# Altium project RBCM_Mother.PrjPcb (part 2 of 2)

## Sheet Sheet2.SchDoc: RBCM_Mother
size 419 x 297 mm; SheetNumber: 2; SheetTotal: 3; SCH_SCALE: Not to Scale; PrjRev: A; DocRev: A; Team: WUTE Racing Team
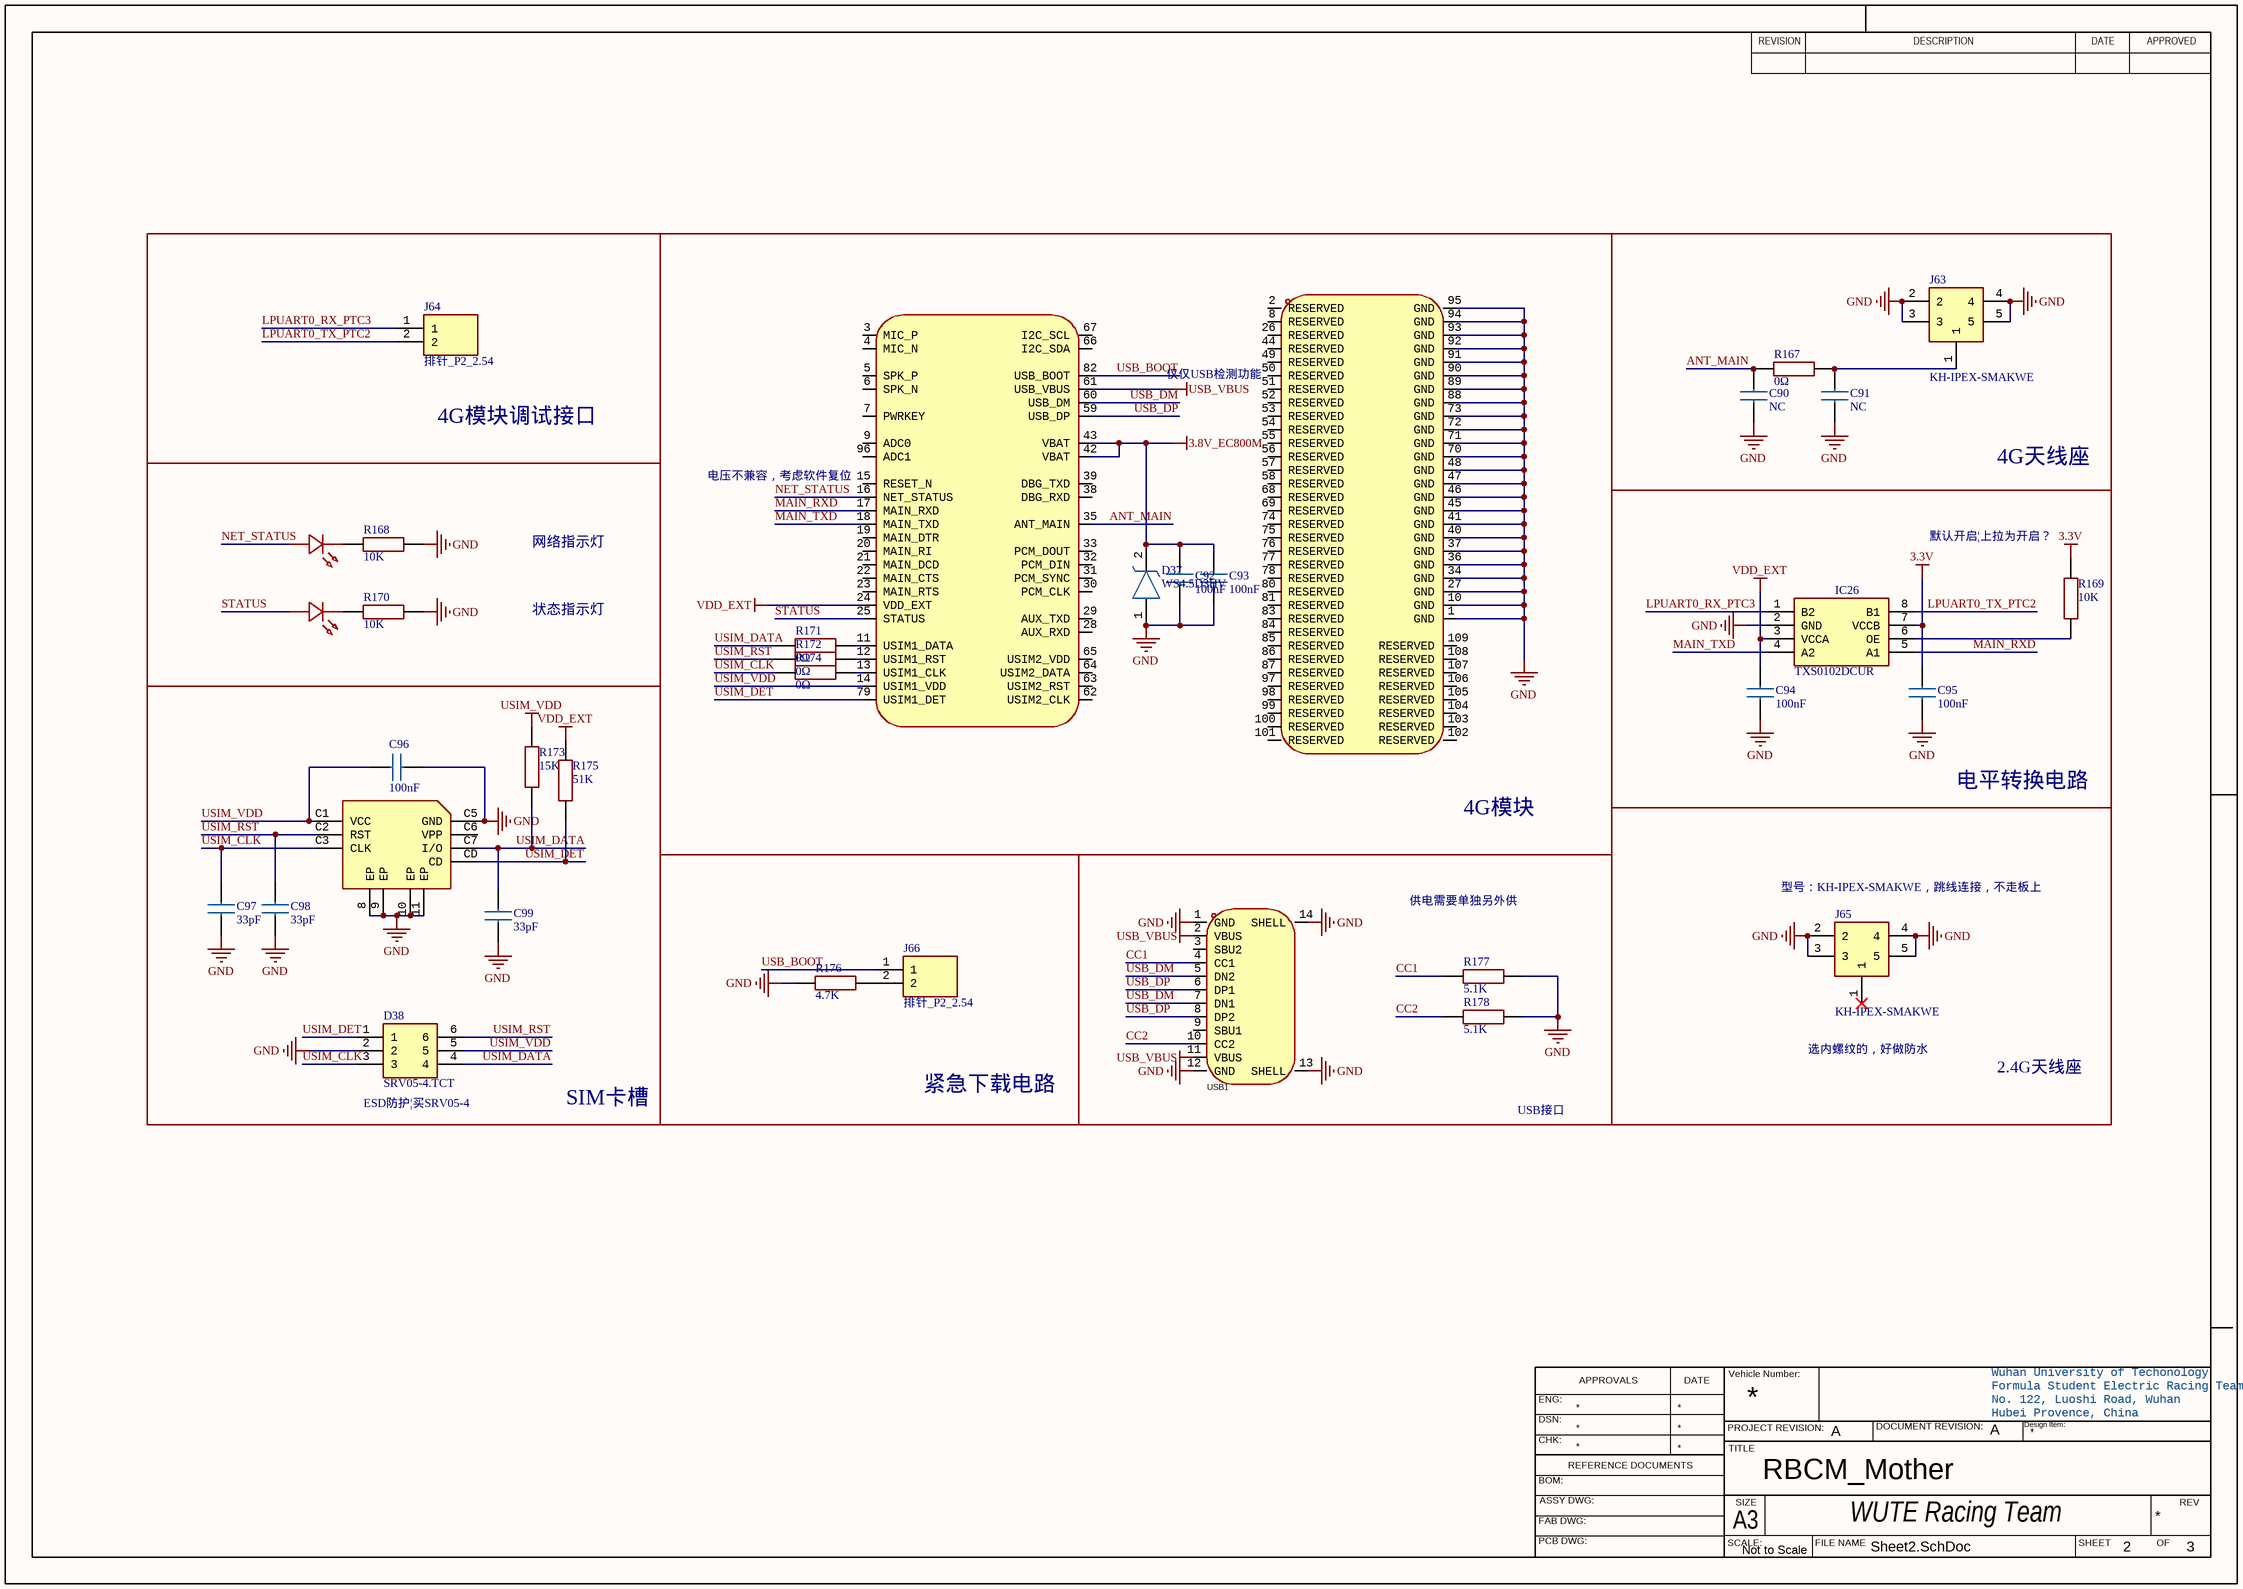
[diagram p6: Sheet2.SchDoc]

### Parts
C90  NC  [CAPC1608X90N]
C91  NC  [CAPC1608X90N]
C92  100nF  [CAPC1608X90N]
C93  100nF  [CAPC1608X90N]
C94  100nF  [CAPC1608X90N]
C95  100nF  [CAPC1608X90N]
C96  100nF  [CAPC1608X90N]
C97  33pF  [CAPC1608X90N]
C98  33pF  [CAPC1608X90N]
C99  33pF  [CAPC1608X90N]
CARD1  SMN-303  [SIM-SMD_SMN-303]  (value not drawn)
D37  WS4.5D3HV  [WS45D3HV]
D38  SRV05-4.TCT  [SOT95P280X145-6N]
IC26  TXS0102DCUR  [SOP50P310X90-8N]
J63  KH-IPEX-SMAKWE  [KHIPEXSMAKWE]
J64  排针_P2_2.54  [HDRV2W66P0X254_1X2_508X250X880P]
J65  KH-IPEX-SMAKWE  [KHIPEXSMAKWE]
J66  排针_P2_2.54  [HDRV2W66P0X254_1X2_508X250X880P]
LED3  XL-1606UGC  [LED-SMD_L1.7-W1.1-R-RD_GREEN]  (value not drawn)
LED4  XL-1606UGC  [LED-SMD_L1.7-W1.1-R-RD_GREEN]  (value not drawn)
R167  0Ω  [RESC1608X55N]
R168  10K  [RESC1608X55N]
R169  10K  [RESC1608X55N]
R170  10K  [RESC1608X55N]
R171  0Ω  [RESC1608X55N]
R172  0Ω  [RESC1608X55N]
R173  15K  [RESC1608X55N]
R174  0Ω  [RESC1608X55N]
R175  51K  [RESC1608X55N]
R176  4.7K  [RESC1608X55N]
R177  5.1K  [RESC1608X55N]
R178  5.1K  [RESC1608X55N]
U2  EC800MCNGA-I05-SGNSA  [LCC-109_L17.7-W15.8-P1.10_EC800M-CN]  (value not drawn)  (parts A,B of 2)
USB1  TYPE-C 16PIN 2MD(073)  [USB-C-SMD_TYPE-C-6PIN-2MD-073]  (value not drawn)

### Blocks framed on the sheet
4G模块调试接口: J64
4G模块: C92 C93 D37 R171 R172 R174 U2
4G天线座: C90 C91 J63 R167
默认开启¦上拉为开启？: C94 C95 IC26 R169
SIM卡槽: C96-C99 CARD1 D38 R173 R175
紧急下载电路: J66 R176
电平转换电路: J65

### Nets
3.3V: C95.1 IC26.7(VCCB) R169.1
3.8V_EC800M: C92.2 C93.2 D37.2(K) U2.42(VBAT) U2.43(VBAT)
GND: C90.1 C91.1 C92.1 C93.1 C94.2 C95.2 C96.1 C97.2 C98.2 C99.2 CARD1.8(EP) CARD1.9(EP) CARD1.10(EP) CARD1.11(EP) CARD1.C5(GND) D37.1(A) D38.2 IC26.2(GND) J63.2 J63.3 J63.4 J63.5 J65.2 J65.3 J65.4 J65.5 R168.1 R170.1 R176.1 R177.2 R178.2 U2.1(GND) U2.10(GND) U2.27(GND) U2.34(GND) U2.36(GND) U2.37(GND) U2.40(GND) U2.41(GND) U2.45(GND) U2.46(GND) U2.47(GND) U2.48(GND) U2.70(GND) U2.71(GND) U2.72(GND) U2.73(GND) U2.88(GND) U2.89(GND) U2.90(GND) U2.91(GND) U2.92(GND) U2.93(GND) U2.94(GND) U2.95(GND) USB1.1(GND) USB1.12(GND) USB1.13(SHELL) USB1.14(SHELL)
USB_VBUS: U2.61(USB_VBUS) USB1.2(VBUS) USB1.11(VBUS)
USIM_VDD: C96.2 CARD1.C1(VCC) D38.5 R173.2 U2.14(USIM1_VDD)
VDD_EXT: C94.1 IC26.3(VCCA) R175.2 U2.24(VDD_EXT)
ANT_MAIN: C90.2 R167.1 U2.35(ANT_MAIN)
CC1: R177.1 USB1.4(CC1)
CC2: R178.1 USB1.10(CC2)
LPUART0_RX_PTC3: IC26.1(B2) J64.1
LPUART0_TX_PTC2: IC26.8(B1) J64.2
MAIN_RXD: IC26.5(A1) U2.17(MAIN_RXD)
MAIN_TXD: IC26.4(A2) U2.18(MAIN_TXD)
NET_STATUS: LED3.1(A) U2.16(NET_STATUS)
STATUS: LED4.1(A) U2.25(STATUS)
USB_BOOT: J66.1 U2.82(USB_BOOT)
USB_DM: U2.60(USB_DM) USB1.5(DN2) USB1.7(DN1)
USB_DP: U2.59(USB_DP) USB1.6(DP1) USB1.8(DP2)
USIM_CLK: C97.1 CARD1.C3(CLK) D38.3 R174.1
USIM_DATA: C99.1 CARD1.C7(I/O) D38.4 R171.1 R173.1
USIM_DET: CARD1.CD D38.1 R175.1 U2.79(USIM1_DET)
USIM_RST: C98.1 CARD1.C2(RST) D38.6 R172.1
NetC91_2: C91.2 J63.1 R167.2
NetIC26_6: IC26.6(OE) R169.2
NetJ66_2: J66.2 R176.2
NetLED3_2: LED3.2(K) R168.2
NetLED4_2: LED4.2(K) R170.2
NetR171_2: R171.2 U2.11(USIM1_DATA)
NetR172_2: R172.2 U2.12(USIM1_RST)
NetR174_2: R174.2 U2.13(USIM1_CLK)

Not connected (* = marked no-connect by the designer): CARD1 C6(VPP); J65 1*; U2 2(RESERVED) 3(MIC_P) 4(MIC_N) 5(SPK_P) 6(SPK_N) 7(PWRKEY) 8(RESERVED) 9(ADC0) 15(RESET_N) 19(MAIN_DTR) 20(MAIN_RI) 21(MAIN_DCD) 22(MAIN_CTS) 23(MAIN_RTS) 26(RESERVED) 28(AUX_RXD) 29(AUX_TXD) 30(PCM_CLK) 31(PCM_SYNC) 32(PCM_DIN) 33(PCM_DOUT) 38(DBG_RXD) 39(DBG_TXD) 44(RESERVED) 49(RESERVED) 50(RESERVED) 51(RESERVED) 52(RESERVED) 53(RESERVED) 54(RESERVED) 55(RESERVED) 56(RESERVED) 57(RESERVED) 58(RESERVED) 62(USIM2_CLK) 63(USIM2_RST) 64(USIM2_DATA) 65(USIM2_VDD) 66(I2C_SDA) 67(I2C_SCL) 68(RESERVED) 69(RESERVED) 74(RESERVED) 75(RESERVED) 76(RESERVED) 77(RESERVED) 78(RESERVED) 80(RESERVED) 81(RESERVED) 83(RESERVED) 84(RESERVED) 85(RESERVED) 86(RESERVED) 87(RESERVED) 96(ADC1) 97(RESERVED) 98(RESERVED) 99(RESERVED) 100(RESERVED) 101(RESERVED) 102(RESERVED) 103(RESERVED) 104(RESERVED) 105(RESERVED) 106(RESERVED) 107(RESERVED) 108(RESERVED) 109(RESERVED); USB1 3(SBU2) 9(SBU1)

### Notes on the sheet
- 仅仅USB检测功能
- 电压不兼容，考虑软件复位
- 网络指示灯
- 状态指示灯
- 供电需要单独另外供
- (near J65) 型号：KH-IPEX-SMAKWE，跳线连接，不走板上
- 选内螺纹的，好做防水
- 2.4G天线座
- (near D38) ESD防护¦买SRV05-4
- USB接口
- REVISION
- DESCRIPTION
- DATE
- APPROVED
- ENG:
- APPROVALS
- Vehicle Number:
- Wuhan University of Techonology
- Formula Student Electric Racing Team
- No. 122, Luoshi Road, Wuhan
- DSN:
- CHK:
- REFERENCE DOCUMENTS
- PROJECT REVISION:
- TITLE
- DOCUMENT REVISION:
- Hubei Provence, China
- Design Item:
- BOM:
- FAB DWG:
- PCB DWG:
- ASSY DWG:
- SCALE:
- A3
- SIZE
- FILE NAME
- SHEET
- OF
- REV

### Library data of the parts
C90-C93 C96-C99 = C0603: Capacitor; Manufacturer_Name: YAGEO; Manufacturer_Part_Number: CC0603KRX7R9BB104; Datasheet Link: https://componentsearchengine.com/Datasheets/2/CC0603KRX7R9BB104.pdf; Height: 0.9mm; Mouser Part Number: 603-CC603KRX7R9BB104; Mouser Price/Stock: https://www.mouser.co.uk/ProductDetail/YAGEO/CC0603KRX7R9BB104?qs=vTakOoo5QyLvVCYM2ge8LQ%3D%3D; Arrow Part Number: CC0603KRX7R9BB104; Arrow Price/Stock: https://www.arrow.com/en/products/cc0603krx7r9bb104/yageo?region=europe
C94 C95 = C0603: Capacitor CC0603KRX7R9BB104; Manufacturer_Name: YAGEO; Datasheet Link: https://componentsearchengine.com/Datasheets/2/CC0603KRX7R9BB104.pdf; Height: 0.9mm; Manufacturer_Part_Number: CC0603KRX7R9BB104; Mouser Part Number: 603-CC603KRX7R9BB104; Mouser Price/Stock: https://www.mouser.co.uk/ProductDetail/YAGEO/CC0603KRX7R9BB104?qs=vTakOoo5QyLvVCYM2ge8LQ%3D%3D; Arrow Part Number: CC0603KRX7R9BB104; Arrow Price/Stock: https://www.arrow.com/en/products/cc0603krx7r9bb104/yageo?region=europe
CARD1 = SMN-303: Manufacturer: XUNPU(讯普); Add into BOM: yes; Card Connection Mode: 自弹式; Card Type: NanoSIM卡; Connector Type: 卡座; Card Detection: 有插卡检测; Body Height (Max): 1.37mm; Symbol: SMN-303; Device: SMN-303; LCSC Part Name: 自弹式 NanoSIM卡 卡座; Supplier Part: C266888; Manufacturer Part: SMN-303; Supplier Footprint: SMD; JLCPCB Part Class: Extended Part; Datasheet: https://atta.szlcsc.com/upload/public/pdf/source/20230608/69FA23A73293DEADC31E393DD83871F4.pdf; Supplier: LCSC; Convert to PCB: yes; Supplementary Features: -; Operating Temperature Range: -40℃~+85℃
D37 = WS4.5D3HV: TVS Diode (Uni-directional); Manufacturer_Name: Way-On; Datasheet Link: https://www.way-on.com/upload/201807/31/201807311326214442.pdf; Height: 0.7mm; Manufacturer_Part_Number: WS4.5D3HV
D38 = SRV05-4.TCT: TVS Diode (Uni-directional); Manufacturer_Name: SEMTECH; Datasheet Link: https://datasheet.datasheetarchive.com/originals/distributors/Datasheets-DGA26/1842016.pdf; Height: 1.45mm; Manufacturer_Part_Number: SRV05-4.TCT; Mouser Part Number: 947-SRV05-4.TCT; Mouser Price/Stock: https://www.mouser.co.uk/ProductDetail/Semtech/SRV05-4.TCT?qs=rBWM4%252BvDhIe0tfPjqKjR5Q%3D%3D; Arrow Part Number: SRV05-4.TCT; Arrow Price/Stock: https://www.arrow.com/en/products/srv05-4.tct/semtech?utm_currency=USD&region=nac
IC26 = TXS0102DCUR: Integrated Circuit; Manufacturer_Name: Texas Instruments; Datasheet Link: https://datasheet.datasheetarchive.com/originals/distributors/SFDatasheet-7/sf-000145437.pdf; Height: 0.9mm; Manufacturer_Part_Number: TXS0102DCUR; Mouser Part Number: 595-TXS0102DCUR; Mouser Price/Stock: https://www.mouser.co.uk/ProductDetail/Texas-Instruments/TXS0102DCUR?qs=dB0LedT%252BmmBcQ3I%2Fs9XEDA%3D%3D; Arrow Part Number: TXS0102DCUR; Arrow Price/Stock: https://www.arrow.com/en/products/txs0102dcur/texas-instruments?utm_currency=USD&region=nac
J63 J65 = KH-IPEX-SMAKWE: Connector; Manufacturer_Name: Shenzhen Kinghelm Elec; Datasheet Link: https://amel.ru/upload/iblock/99e/SMA-KWHD.pdf; Height: 9.7mm; Manufacturer_Part_Number: KH-IPEX-SMAKWE
J64 J66 = 排针_P2_2.54: Connector; Manufacturer_Name: Ckmtw(Shenzhen Cankemeng); Manufacturer_Part_Number: B-2100S02P-A110; Datasheet Link: https://datasheet.lcsc.com/lcsc/2210192330_Ckmtw-Shenzhen-Cankemeng-B-2100S02P-A110_C124375.pdf; Height: 8.8mm
LED3 LED4 = XL-1606UGC: Manufacturer: XINGLIGHT(成兴光); Add into BOM: yes; Emitted Color: 翠绿色; Power Dissipation: 80mW; Forward Current: 25mA; Dominant Wavelength: 520nm~530nm; Peak Wavelength: 535nm; Lens Color: 无色透明透镜; Viewing Angle: 120°; Mounting Sytle: 侧贴; Symbol: XL-1606UGC; Device: XL-1606UGC; LCSC Part Name: XL-1606UGC; Supplier Part: C965863; Manufacturer Part: XL-1606UGC; Supplier Footprint: SMD,1.1x1.7mm; JLCPCB Part Class: Extended Part; Datasheet: https://atta.szlcsc.com/upload/public/pdf/source/20221102/94FA3AB05D9E652787BBD0AFAAE97065.pdf; Supplier: LCSC; Convert to PCB: yes; Color Temperature: -; Operating Temperature: -30℃~+85℃
R167 R168 R170-R176 = R0603: Resistor; Manufacturer_Name: UNI-ROYAL(Uniroyal Elec); Manufacturer_Part_Number: 0603WAF1002T5E; Datasheet Link: https://datasheet.lcsc.com/szlcsc/Uniroyal-Elec-0603WAF1002T5E_C25804.pdf; Height: 0.55mm
R169 R177 R178 = R0603: Resistor 0603WAF1002T5E; Manufacturer_Name: UNI-ROYAL(Uniroyal Elec); Datasheet Link: https://datasheet.lcsc.com/szlcsc/Uniroyal-Elec-0603WAF1002T5E_C25804.pdf; Height: 0.55mm; Manufacturer_Part_Number: 0603WAF1002T5E
U2 = EC800MCNGA-I05-SGNSA: Manufacturer: Quectel(移远); Add into BOM: yes; Symbol: EC800MCNGA-I05-SGNSA; Device: EC800MCNGA-I05-SGNSA; LCSC Part Name: LTE Standard 模块 停产; Supplier Part: C5200736; Manufacturer Part: EC800MCNGA-I05-SGNSA; Supplier Footprint: SMD,15.8x17.7mm; JLCPCB Part Class: Extended Part; Datasheet: https://atta.szlcsc.com/upload/public/pdf/source/20221128/3247853C8E24B9EB0EE07D4BC508718A.pdf; Supplier: LCSC; Convert to PCB: yes
USB1 = TYPE-C 16PIN 2MD(073): Manufacturer: SHOU HAN(首韩); Add into BOM: yes; Gender: 母; Number of Contacts: 16P; Number of Ports: 1; Current Rating - Power (Max): 5A; Rated Voltage (Max): 5V; Connect-Disconnect Life: 5千次; Core Colour: 黑色; Symbol: TYPE-C 16PIN 2MD(073); Device: TYPE-C 16PIN 2MD(073); LCSC Part Name: Type-C 母 卧贴; Supplier Part: C2765186; Manufacturer Part: TYPE-C 16PIN 2MD(073); Supplier Footprint: SMD; JLCPCB Part Class: Extended Part; Datasheet: https://atta.szlcsc.com/upload/public/pdf/source/20211123/39B17C16241EAC15C5E277BDA434118E.pdf; Supplier: LCSC; Convert to PCB: yes; Connector Type: Type-C; Standard: USB 3.1; Mounting Style: 卧贴; Operating Temperature Range: -25℃~+85℃

## Sheet Sheet4.SchDoc: RBCM_Mother
size 419 x 297 mm; SheetNumber: 3; SheetTotal: 3
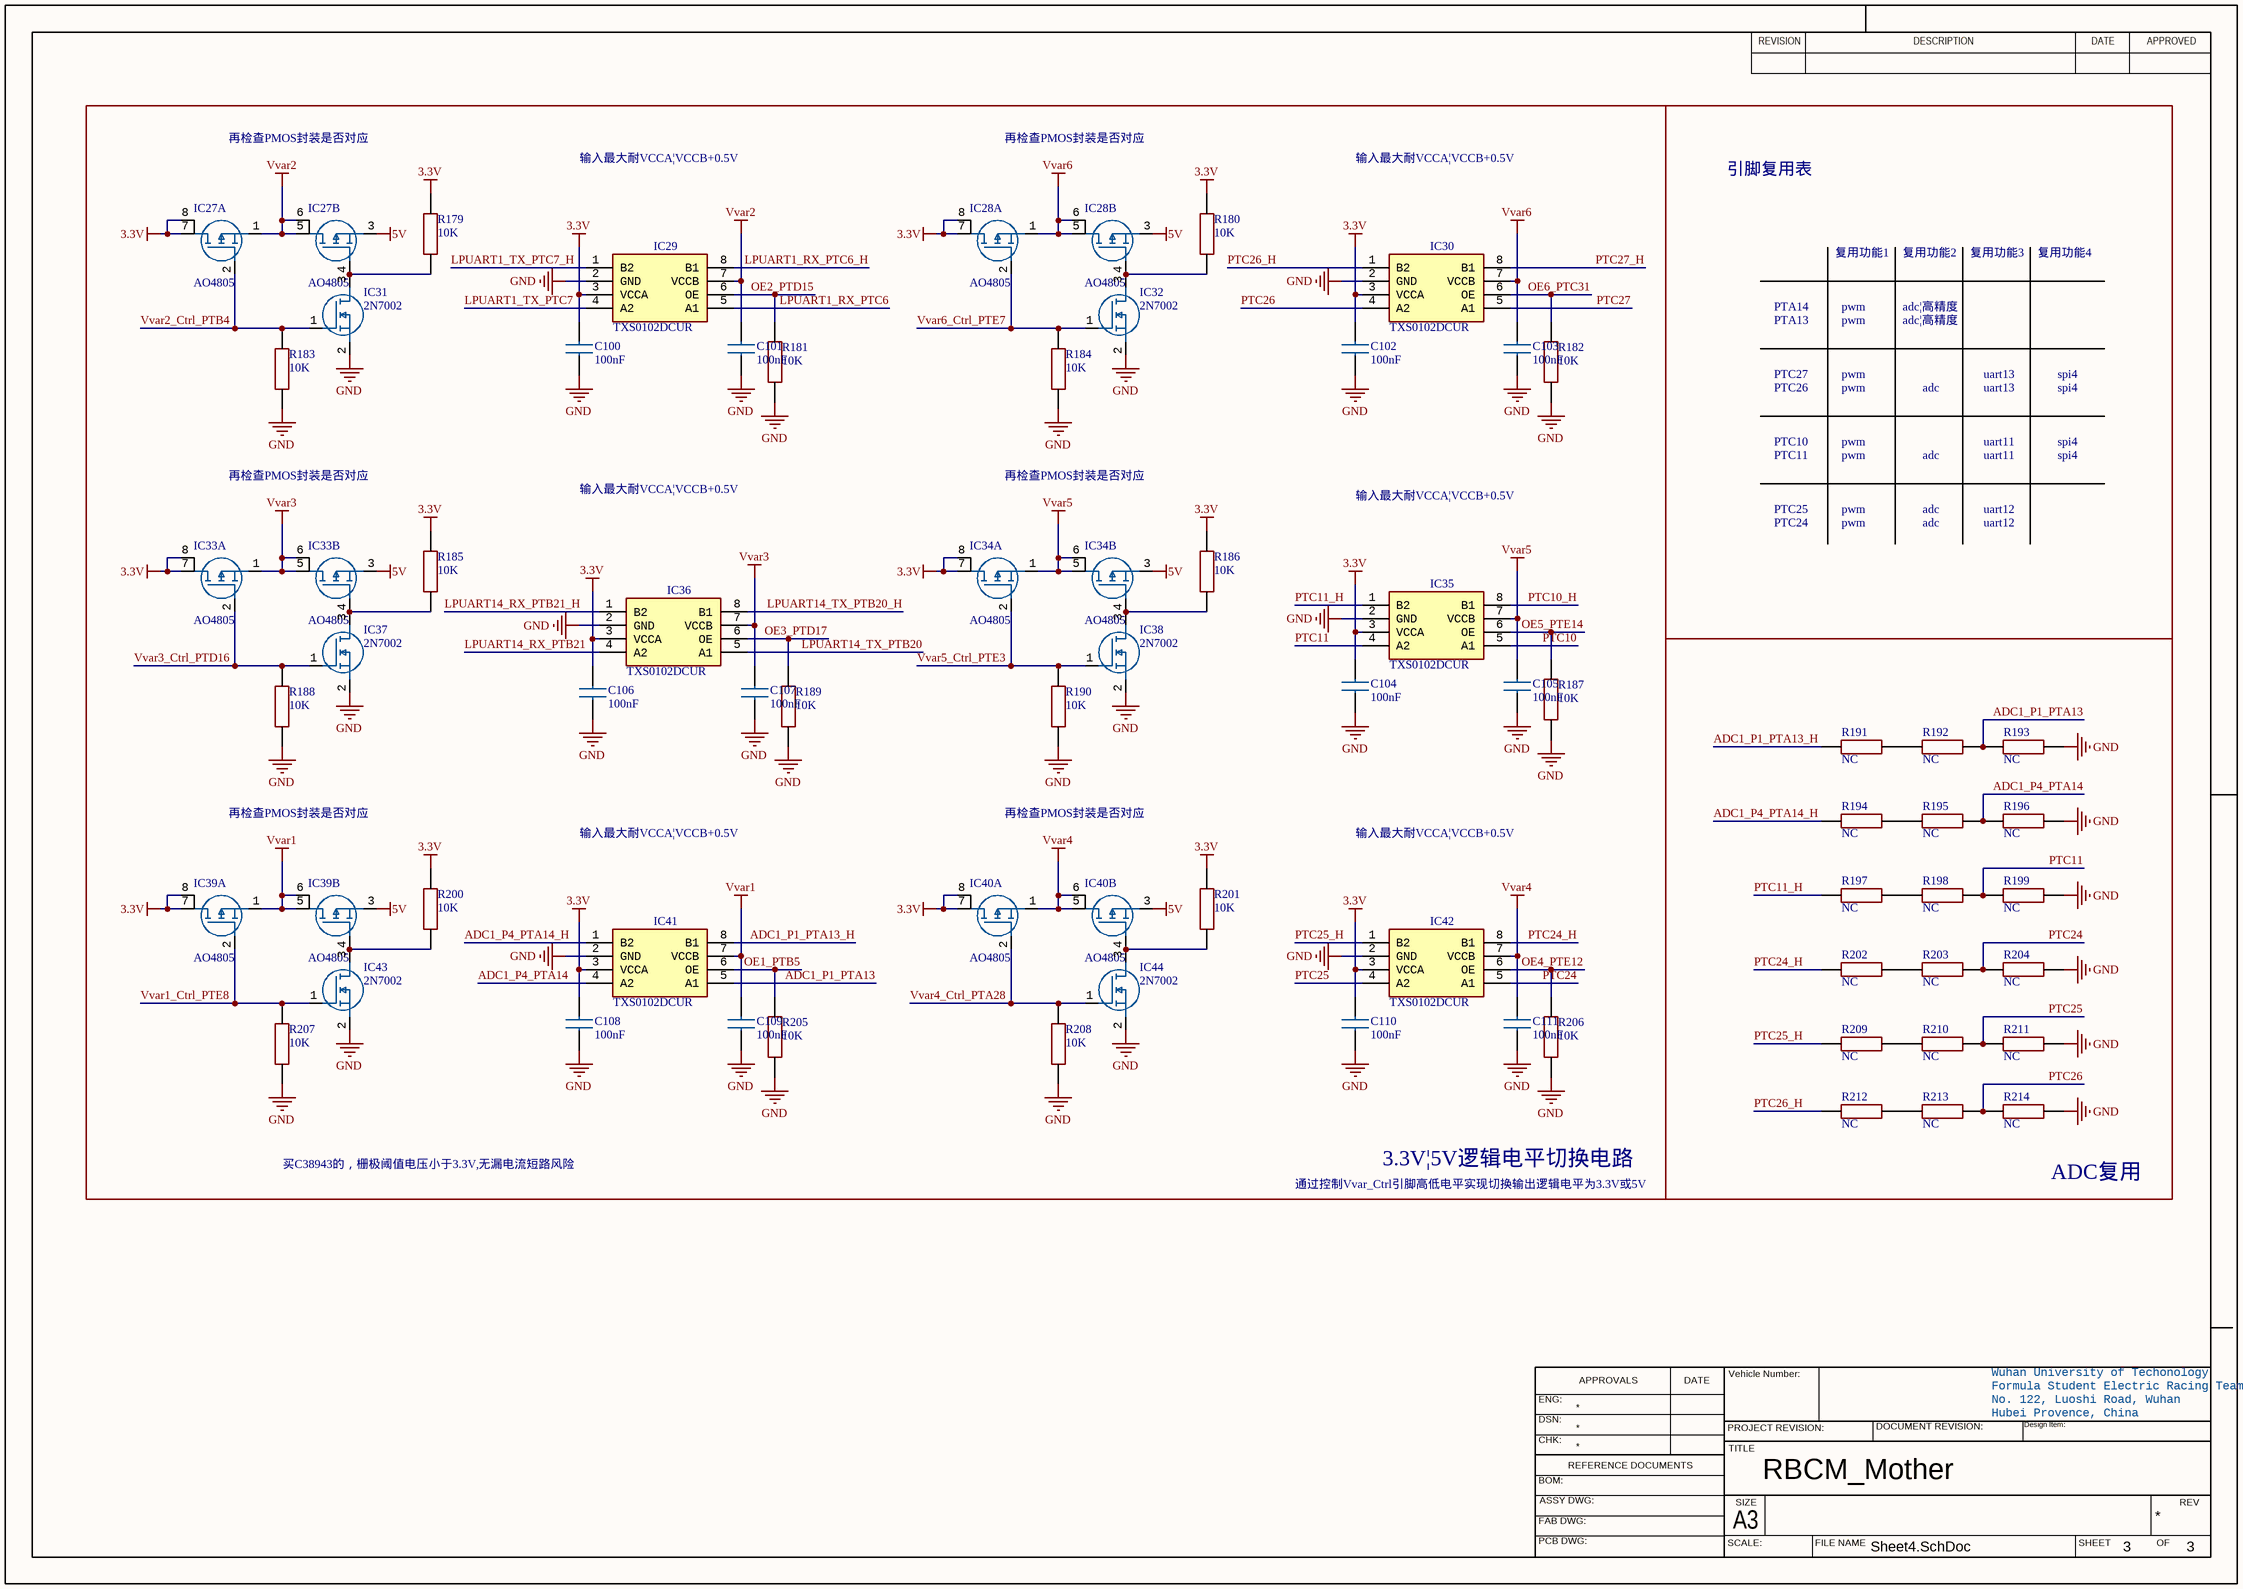
[diagram p7: Sheet4.SchDoc]

### Parts
C100  100nF  [CAPC1608X90N]
C101  100nF  [CAPC1608X90N]
C102  100nF  [CAPC1608X90N]
C103  100nF  [CAPC1608X90N]
C104  100nF  [CAPC1608X90N]
C105  100nF  [CAPC1608X90N]
C106  100nF  [CAPC1608X90N]
C107  100nF  [CAPC1608X90N]
C108  100nF  [CAPC1608X90N]
C109  100nF  [CAPC1608X90N]
C110  100nF  [CAPC1608X90N]
C111  100nF  [CAPC1608X90N]
IC27  AO4805  [SOIC127P600X175-8N_AO4805]  (parts A,B of 2)
IC28  AO4805  [SOIC127P600X175-8N_AO4805]  (parts A,B of 2)
IC29  TXS0102DCUR  [SOP50P310X90-8N]
IC30  TXS0102DCUR  [SOP50P310X90-8N]
IC31  2N7002  [SOT95P230X110-3N]
IC32  2N7002  [SOT95P230X110-3N]
IC33  AO4805  [SOIC127P600X175-8N_AO4805]  (parts A,B of 2)
IC34  AO4805  [SOIC127P600X175-8N_AO4805]  (parts A,B of 2)
IC35  TXS0102DCUR  [SOP50P310X90-8N]
IC36  TXS0102DCUR  [SOP50P310X90-8N]
IC37  2N7002  [SOT95P230X110-3N]
IC38  2N7002  [SOT95P230X110-3N]
IC39  AO4805  [SOIC127P600X175-8N_AO4805]  (parts A,B of 2)
IC40  AO4805  [SOIC127P600X175-8N_AO4805]  (parts A,B of 2)
IC41  TXS0102DCUR  [SOP50P310X90-8N]
IC42  TXS0102DCUR  [SOP50P310X90-8N]
IC43  2N7002  [SOT95P230X110-3N]
IC44  2N7002  [SOT95P230X110-3N]
R179  10K  [RESC1608X55N]
R180  10K  [RESC1608X55N]
R181  10K  [RESC1608X55N]
R182  10K  [RESC1608X55N]
R183  10K  [RESC1608X55N]
R184  10K  [RESC1608X55N]
R185  10K  [RESC1608X55N]
R186  10K  [RESC1608X55N]
R187  10K  [RESC1608X55N]
R188  10K  [RESC1608X55N]
R189  10K  [RESC1608X55N]
R190  10K  [RESC1608X55N]
R191  NC  [RESC1608X55N]
R192  NC  [RESC1608X55N]
R193  NC  [RESC1608X55N]
R194  NC  [RESC1608X55N]
R195  NC  [RESC1608X55N]
R196  NC  [RESC1608X55N]
R197  NC  [RESC1608X55N]
R198  NC  [RESC1608X55N]
R199  NC  [RESC1608X55N]
R200  10K  [RESC1608X55N]
R201  10K  [RESC1608X55N]
R202  NC  [RESC1608X55N]
R203  NC  [RESC1608X55N]
R204  NC  [RESC1608X55N]
R205  10K  [RESC1608X55N]
R206  10K  [RESC1608X55N]
R207  10K  [RESC1608X55N]
R208  10K  [RESC1608X55N]
R209  NC  [RESC1608X55N]
R210  NC  [RESC1608X55N]
R211  NC  [RESC1608X55N]
R212  NC  [RESC1608X55N]
R213  NC  [RESC1608X55N]
R214  NC  [RESC1608X55N]

### Blocks framed on the sheet
3.3V|5V逻辑电平切换电路: C100-C111 IC27-IC44 R179-R190 R200 R201 R205-R208
ADC复用: R191-R199 R202-R204 R209-R214

### Nets
3.3V: C100.1 C102.1 C104.1 C106.1 C108.1 C110.1 IC27.7(D2) IC27.8(D2) IC28.7(D2) IC28.8(D2) IC29.3(VCCA) IC30.3(VCCA) IC33.7(D2) IC33.8(D2) IC34.7(D2) IC34.8(D2) IC35.3(VCCA) IC36.3(VCCA) IC39.7(D2) IC39.8(D2) IC40.7(D2) IC40.8(D2) IC41.3(VCCA) IC42.3(VCCA) R179.1 R180.1 R185.1 R186.1 R200.1 R201.1
5V: IC27.3(S1) IC28.3(S1) IC33.3(S1) IC34.3(S1) IC39.3(S1) IC40.3(S1)
GND: C100.2 C101.2 C102.2 C103.2 C104.2 C105.2 C106.2 C107.2 C108.2 C109.2 C110.2 C111.2 IC29.2(GND) IC30.2(GND) IC31.2(S) IC32.2(S) IC35.2(GND) IC36.2(GND) IC37.2(S) IC38.2(S) IC41.2(GND) IC42.2(GND) IC43.2(S) IC44.2(S) R181.2 R182.2 R183.2 R184.2 R187.2 R188.2 R189.2 R190.2 R193.2 R196.2 R199.2 R204.2 R205.2 R206.2 R207.2 R208.2 R211.2 R214.2
Vvar1: C109.1 IC39.1(S2) IC39.5(D1) IC39.6(D1) IC41.7(VCCB)
Vvar2: C101.1 IC27.1(S2) IC27.5(D1) IC27.6(D1) IC29.7(VCCB)
Vvar3: C107.1 IC33.1(S2) IC33.5(D1) IC33.6(D1) IC36.7(VCCB)
Vvar4: C111.1 IC40.1(S2) IC40.5(D1) IC40.6(D1) IC42.7(VCCB)
Vvar5: C105.1 IC34.1(S2) IC34.5(D1) IC34.6(D1) IC35.7(VCCB)
Vvar6: C103.1 IC28.1(S2) IC28.5(D1) IC28.6(D1) IC30.7(VCCB)
ADC1_P1_PTA13: IC41.5(A1) R192.2 R193.1
ADC1_P1_PTA13_H: IC41.8(B1) R191.1
ADC1_P4_PTA14: IC41.4(A2) R195.2 R196.1
ADC1_P4_PTA14_H: IC41.1(B2) R194.1
LPUART1_RX_PTC6: IC29.5(A1)
LPUART1_RX_PTC6_H: IC29.8(B1)
LPUART1_TX_PTC7: IC29.4(A2)
LPUART1_TX_PTC7_H: IC29.1(B2)
LPUART14_RX_PTB21: IC36.4(A2)
LPUART14_RX_PTB21_H: IC36.1(B2)
LPUART14_TX_PTB20: IC36.5(A1)
LPUART14_TX_PTB20_H: IC36.8(B1)
OE1_PTB5: IC41.6(OE) R205.1
OE2_PTD15: IC29.6(OE) R181.1
OE3_PTD17: IC36.6(OE) R189.1
OE4_PTE12: IC42.6(OE) R206.1
OE5_PTE14: IC35.6(OE) R187.1
OE6_PTC31: IC30.6(OE) R182.1
PTC10: IC35.5(A1)
PTC10_H: IC35.8(B1)
PTC11: IC35.4(A2) R198.2 R199.1
PTC11_H: IC35.1(B2) R197.1
PTC24: IC42.5(A1) R203.2 R204.1
PTC24_H: IC42.8(B1) R202.1
PTC25: IC42.4(A2) R210.2 R211.1
PTC25_H: IC42.1(B2) R209.1
PTC26: IC30.4(A2) R213.2 R214.1
PTC26_H: IC30.1(B2) R212.1
PTC27: IC30.5(A1)
PTC27_H: IC30.8(B1)
Vvar1_Ctrl_PTE8: IC39.2(G2) IC43.1(G) R207.1
Vvar2_Ctrl_PTB4: IC27.2(G2) IC31.1(G) R183.1
Vvar3_Ctrl_PTD16: IC33.2(G2) IC37.1(G) R188.1
Vvar4_Ctrl_PTA28: IC40.2(G2) IC44.1(G) R208.1
Vvar5_Ctrl_PTE3: IC34.2(G2) IC38.1(G) R190.1
Vvar6_Ctrl_PTE7: IC28.2(G2) IC32.1(G) R184.1
NetIC27_4: IC27.4(G1) IC31.3(D) R179.2
NetIC28_4: IC28.4(G1) IC32.3(D) R180.2
NetIC33_4: IC33.4(G1) IC37.3(D) R185.2
NetIC34_4: IC34.4(G1) IC38.3(D) R186.2
NetIC39_4: IC39.4(G1) IC43.3(D) R200.2
NetIC40_4: IC40.4(G1) IC44.3(D) R201.2
NetR191_2: R191.2 R192.1
NetR194_2: R194.2 R195.1
NetR197_2: R197.2 R198.1
NetR202_2: R202.2 R203.1
NetR209_2: R209.2 R210.1
NetR212_2: R212.2 R213.1

### Notes on the sheet
- 再检查PMOS封装是否对应
- 输入最大耐VCCA|VCCB+0.5V
- 引脚复用表
- 复用功能1
- 复用功能2
- 复用功能3
- 复用功能4
- PTA14
- PTA13
- pwm
- adc¦高精度
- PTC27
- PTC26
- adc
- uart13
- spi4
- PTC10
- PTC11
- uart11
- PTC25
- PTC24
- uart12
- 买C38943的，栅极阈值电压小于3.3V,无漏电流短路风险
- 通过控制Vvar_Ctrl引脚高低电平实现切换输出逻辑电平为3.3V或5V
- REVISION
- DESCRIPTION
- DATE
- APPROVED
- ENG:
- APPROVALS
- Vehicle Number:
- Wuhan University of Techonology
- Formula Student Electric Racing Team
- No. 122, Luoshi Road, Wuhan
- DSN:
- CHK:
- REFERENCE DOCUMENTS
- PROJECT REVISION:
- TITLE
- DOCUMENT REVISION:
- Hubei Provence, China
- Design Item:
- BOM:
- FAB DWG:
- PCB DWG:
- ASSY DWG:
- SCALE:
- A3
- SIZE
- FILE NAME
- SHEET
- OF
- REV

### Library data of the parts
C100-C111 = C0603: as C94 on sheet Sheet2; Datasheet Link: https://componentsearchengine.com/Datasheets/2/CC0603KRX7R9BB104.pdf; Height: 0.9mm; Manufacturer_Part_Number: CC0603KRX7R9BB104; Mouser Part Number: 603-CC603KRX7R9BB104; Mouser Price/Stock: https://www.mouser.co.uk/ProductDetail/YAGEO/CC0603KRX7R9BB104?qs=vTakOoo5QyLvVCYM2ge8LQ%3D%3D; Arrow Part Number: CC0603KRX7R9BB104; Arrow Price/Stock: https://www.arrow.com/en/products/cc0603krx7r9bb104/yageo?region=europe
IC27 IC28 IC33 IC34 IC39 IC40 = AO4805: Integrated Circuit; Manufacturer_Name: Alpha & Omega Semiconductors; Datasheet Link: http://www.aosmd.com/res/data_sheets/AO4805.pdf; Height: 1.75mm; Manufacturer_Part_Number: AO4805; Arrow Part Number: AO4805; Arrow Price/Stock: https://www.arrow.com/en/products/ao4805/alpha-and-omega-semiconductor?utm_currency=USD&region=nac
IC29 IC30 IC35 IC36 IC41 IC42 = TXS0102DCUR: as IC26 on sheet Sheet2; Datasheet Link: https://datasheet.datasheetarchive.com/originals/distributors/SFDatasheet-7/sf-000145437.pdf; Height: 0.9mm; Manufacturer_Part_Number: TXS0102DCUR; Mouser Part Number: 595-TXS0102DCUR; Mouser Price/Stock: https://www.mouser.co.uk/ProductDetail/Texas-Instruments/TXS0102DCUR?qs=dB0LedT%252BmmBcQ3I%2Fs9XEDA%3D%3D; Arrow Part Number: TXS0102DCUR; Arrow Price/Stock: https://www.arrow.com/en/products/txs0102dcur/texas-instruments?utm_currency=USD&region=nac
IC31 IC32 IC37 IC38 IC43 IC44 = 2N7002: Integrated Circuit; Manufacturer_Name: Nylofix; Manufacturer_Part_Number: 2N7002P,235; Datasheet Link: https://4donline.ihs.com/images/VipMasterIC/IC/PHGL/PHGLS21946/PHGLS21946-1.pdf?hkey=EF798316E3902B6ED9A73243A3159BB0; Height: 1.1mm
R179 R180 R183-R186 R188 R190-R204 R207-R214 = R0603: as R167 on sheet Sheet2; Datasheet Link: https://datasheet.lcsc.com/szlcsc/Uniroyal-Elec-0603WAF1002T5E_C25804.pdf; Height: 0.55mm
R181 R182 R187 R189 R205 R206 = R0603: as R169 on sheet Sheet2; Datasheet Link: https://datasheet.lcsc.com/szlcsc/Uniroyal-Elec-0603WAF1002T5E_C25804.pdf; Height: 0.55mm; Manufacturer_Part_Number: 0603WAF1002T5E

## Nets that join several sheets
3.3V: Sheet1 (34 pins), Sheet2 (C95.1 IC26.7 R169.1), Sheet4 (30 pins)
3.8V_EC800M: Sheet1 (C67.2 IC15.4 R108.1), Sheet2 (5 pins)
5V: Sheet1 (13 pins), Sheet4 (6 pins)
GND: Sheet1 (213 pins), Sheet2 (59 pins), Sheet4 (42 pins)
ADC1_P1_PTA13: Sheet1 (BTB1.9), Sheet4 (IC41.5 R192.2 R193.1)
ADC1_P1_PTA13_H: Sheet1 (J19.23), Sheet4 (IC41.8 R191.1)
ADC1_P4_PTA14: Sheet1 (BTB1.12), Sheet4 (IC41.4 R195.2 R196.1)
ADC1_P4_PTA14_H: Sheet1 (J19.22), Sheet4 (IC41.1 R194.1)
LPUART0_RX_PTC3: Sheet1 (BTB2.60), Sheet2 (IC26.1 J64.1)
LPUART0_TX_PTC2: Sheet1 (BTB2.59), Sheet2 (IC26.8 J64.2)
LPUART1_RX_PTC6: Sheet1 (BTB1.17), Sheet4 (IC29.5)
LPUART1_RX_PTC6_H: Sheet1 (J19.15), Sheet4 (IC29.8)
LPUART1_TX_PTC7: Sheet1 (BTB1.18), Sheet4 (IC29.4)
LPUART1_TX_PTC7_H: Sheet1 (J19.8), Sheet4 (IC29.1)
LPUART14_RX_PTB21: Sheet1 (BTB2.2), Sheet4 (IC36.4)
LPUART14_RX_PTB21_H: Sheet1 (J19.7), Sheet4 (IC36.1)
LPUART14_TX_PTB20: Sheet1 (BTB2.1), Sheet4 (IC36.5)
LPUART14_TX_PTB20_H: Sheet1 (J19.14), Sheet4 (IC36.8)
OE1_PTB5: Sheet1 (BTB2.4), Sheet4 (IC41.6 R205.1)
OE2_PTD15: Sheet1 (BTB2.6), Sheet4 (IC29.6 R181.1)
OE3_PTD17: Sheet1 (BTB2.8), Sheet4 (IC36.6 R189.1)
OE4_PTE12: Sheet1 (BTB2.10), Sheet4 (IC42.6 R206.1)
OE5_PTE14: Sheet1 (BTB2.12), Sheet4 (IC35.6 R187.1)
OE6_PTC31: Sheet1 (BTB2.14), Sheet4 (IC30.6 R182.1)
PTC10: Sheet1 (BTB2.25), Sheet4 (IC35.5)
PTC10_H: Sheet1 (J19.6), Sheet4 (IC35.8)
PTC11: Sheet1 (BTB2.23), Sheet4 (IC35.4 R198.2 R199.1)
PTC11_H: Sheet1 (J19.13), Sheet4 (IC35.1 R197.1)
PTC24: Sheet1 (BTB2.21), Sheet4 (IC42.5 R203.2 R204.1)
PTC24_H: Sheet1 (J19.21), Sheet4 (IC42.8 R202.1)
PTC25: Sheet1 (BTB2.22), Sheet4 (IC42.4 R210.2 R211.1)
PTC25_H: Sheet1 (J19.20), Sheet4 (IC42.1 R209.1)
PTC26: Sheet1 (BTB2.24), Sheet4 (IC30.4 R213.2 R214.1)
PTC26_H: Sheet1 (J19.12), Sheet4 (IC30.1 R212.1)
PTC27: Sheet1 (BTB2.26), Sheet4 (IC30.5)
PTC27_H: Sheet1 (J19.5), Sheet4 (IC30.8)
Vvar1_Ctrl_PTE8: Sheet1 (BTB2.3), Sheet4 (IC39.2 IC43.1 R207.1)
Vvar2_Ctrl_PTB4: Sheet1 (BTB2.5), Sheet4 (IC27.2 IC31.1 R183.1)
Vvar3_Ctrl_PTD16: Sheet1 (BTB2.7), Sheet4 (IC33.2 IC37.1 R188.1)
Vvar4_Ctrl_PTA28: Sheet1 (BTB2.9), Sheet4 (IC40.2 IC44.1 R208.1)
Vvar5_Ctrl_PTE3: Sheet1 (BTB2.11), Sheet4 (IC34.2 IC38.1 R190.1)
Vvar6_Ctrl_PTE7: Sheet1 (BTB2.13), Sheet4 (IC28.2 IC32.1 R184.1)